# EAGLE schematic miniArduino (EAGLE 8.4.3)
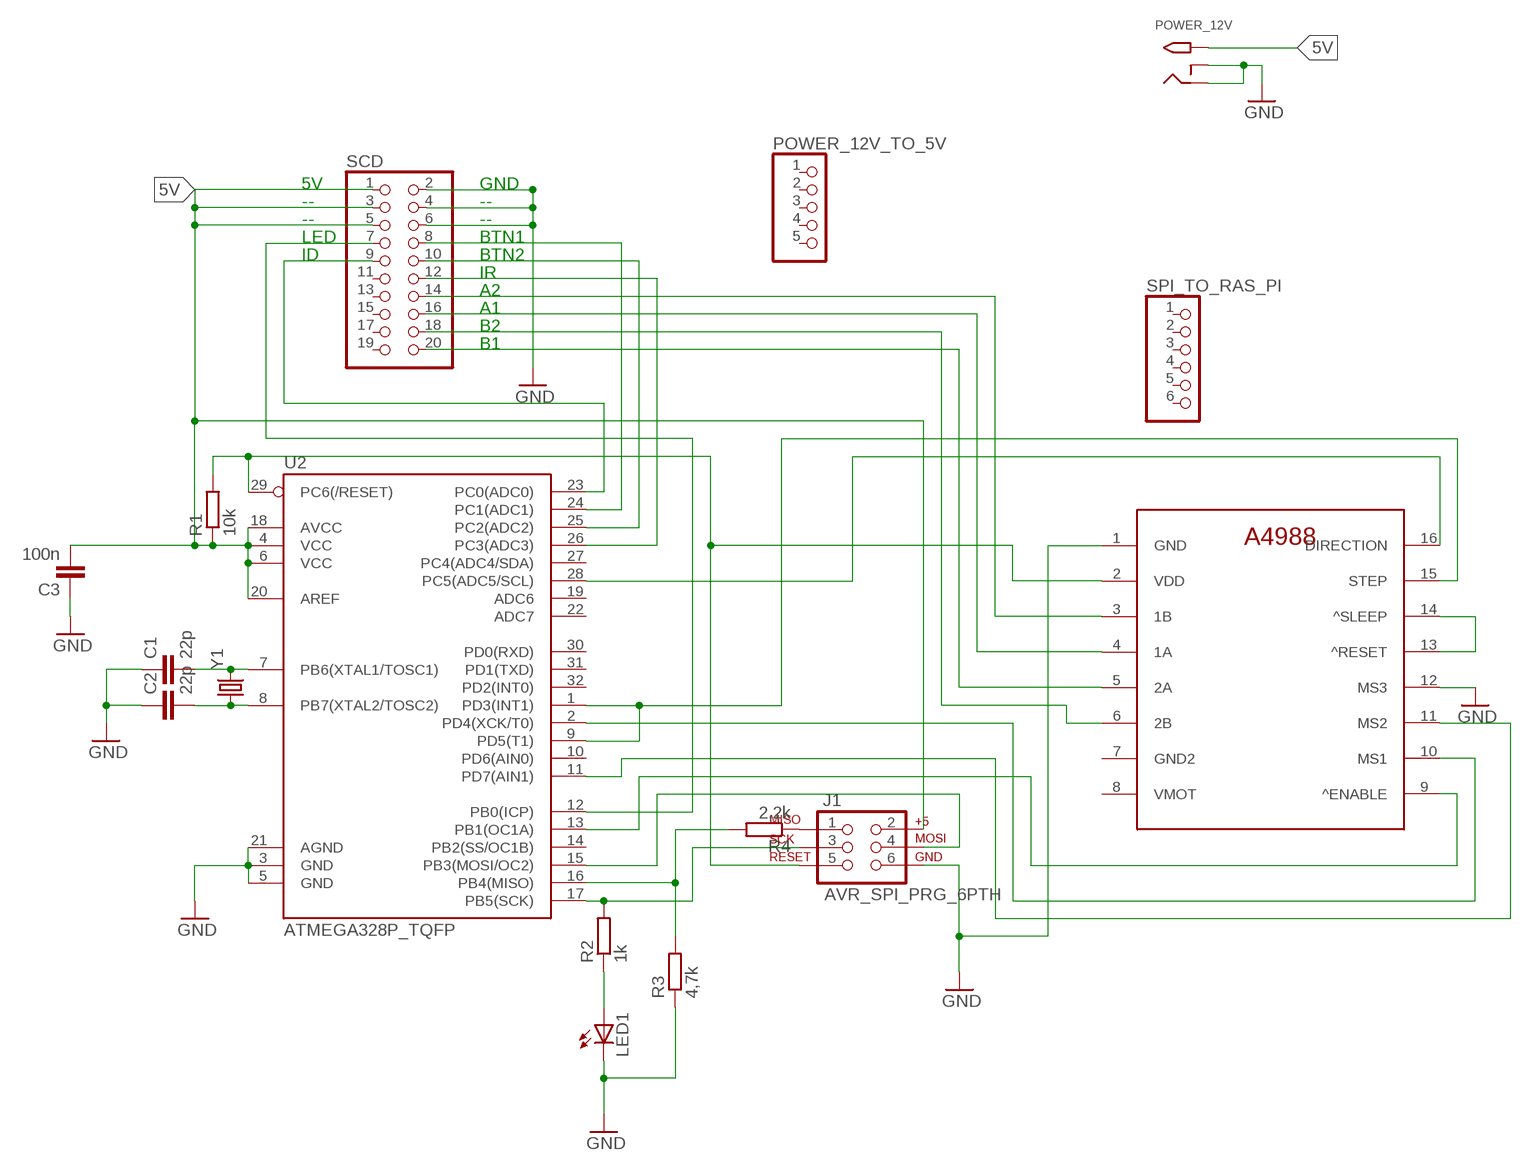
[diagram p0: schematic, sheet 1]

## Parts
C1  22p  C-EUC0805  [C0805]
C2  22p  C-EUC0805  [C0805]
C3  100n  C-EUC0805  [C0805]
J1  AVR_SPI_PRG_6PTH  [2X3]
LED1  LEDCHIP-LED0805  [CHIP-LED0805]
POWER_12V  2.1MMJACKTHM  [PJ-102A]
POWER_12V_TO_5V  PINHD-1X5_2.54  [1X05]
R1  10k  R-EU_R0805  [R0805]
R2  1k  R-EU_R0805  [R0805]
R3  4,7k  R-EU_R0805  [R0805]
R4  2,2k  R-EU_R0805  [R0805]
SCD  PINHD-2X10_2.54  [2X10]
SPI_TO_RAS_PI  PINHD-1X6  [1X06]
U2  ATMEGA328P_TQFP  [TQFP32-08]
U$1  A4998_BREAKOUT  [A4988_BREAKOUT]
Y1  CRYSTALSMD  [HC49UP]

## Nets
5V: POWER_12V.TIP
GND: C1.1 C2.1 C3.1 J1.6 LED1.C POWER_12V.RING POWER_12V.RING_SW R3.1 SCD.2 SCD.4 SCD.6 U2.3(GND) U2.5(GND) U2.21(AGND) U$1.1(GND) U$1.12(MS3)
N$1: R3.2 R4.2 U2.16(PB4(MISO))
N$2: J1.3 R2.2 U2.17(PB5(SCK))
N$3: J1.4 U2.15(PB3(MOSI/OC2))
N$4: SCD.8 U2.24(PC1(ADC1))
N$5: U2.1(PD3(INT1)) U2.9(PD5(T1)) U$1.15(STEP)
N$6: LED1.A R2.1
N$7: J1.5 R1.2 U2.29(PC6(/RESET)) U$1.2(VDD)
N$8: C1.2 U2.7(PB6(XTAL1/TOSC1)) Y1.2
N$9: C2.2 U2.8(PB7(XTAL2/TOSC2)) Y1.1
N$10: U2.13(PB1(OC1A)) U$1.9(^ENABLE)
N$11: U2.2(PD4(XCK/T0)) U$1.10(MS1)
N$12: U2.11(PD7(AIN1)) U$1.11(MS2)
N$13: U$1.13(^RESET) U$1.14(^SLEEP)
N$14: U2.28(PC5(ADC5/SCL)) U$1.16(DIRECTION)
N$15: J1.1 R4.1
N$16: C3.2 J1.2 R1.1 SCD.1 SCD.3 SCD.5 U2.4(VCC) U2.6(VCC) U2.18(AVCC) U2.20(AREF)
N$17: SCD.12 U2.26(PC3(ADC3))
N$18: SCD.14 U$1.3(1B)
N$19: SCD.16 U$1.4(1A)
N$20: SCD.20 U$1.5(2A)
N$21: SCD.18 U$1.6(2B)
N$22: SCD.7 U2.12(PB0(ICP))
N$23: SCD.10 U2.25(PC2(ADC2))
N$24: SCD.9 U2.23(PC0(ADC0))
Unconnected: POWER_12V_TO_5V.1 POWER_12V_TO_5V.2 POWER_12V_TO_5V.3 POWER_12V_TO_5V.4 POWER_12V_TO_5V.5 SCD.11 SCD.13 SCD.15 SCD.17 SCD.19 SPI_TO_RAS_PI.1 SPI_TO_RAS_PI.2 SPI_TO_RAS_PI.3 SPI_TO_RAS_PI.4 SPI_TO_RAS_PI.5 SPI_TO_RAS_PI.6 U2.10(PD6(AIN0)) U2.14(PB2(SS/OC1B)) U2.19(ADC6) U2.22(ADC7) U2.27(PC4(ADC4/SDA)) U2.30(PD0(RXD)) U2.31(PD1(TXD)) U2.32(PD2(INT0)) U$1.7(GND2) U$1.8(VMOT)

## Notes on the sheet
- 5V | GND
- -- | --
- -- | --
- LED | BTN1
- ID | BTN2
- IR
- A2
- A1
- B2
- B1

## Library data of the parts
C1-C3 = rcl:C-EU: CAPACITOR, European symbol
J1 = SparkFun-Connectors:AVR_SPI_PRG_6: AVR ISP 6 Pin This is the reduced ISP connector for AVR programming. Common on Arduino. This footprint will take up less PCB space and can be used with a 10-pin to 6-pin adapter such as SKU: BOB-08508 **Special note about "TEST_POINT" package. The stop mask is on the top side, so if you want your programming test points to be on the bottom of your board, make sure to place this package on the bottom side of the board. This also ensure that the orientation to program from the bottom side will be correct.
LED1 = adafruit:LED: LED OSRAM: - CHIPLED LG R971, LG N971, LY N971, LG Q971, LY Q971, LO R971, LY R971 LH N974, LH R974 LS Q976, LO Q976, LY Q976 LO Q996 - Hyper CHIPLED LW Q18S LB Q993, LB Q99A, LB R99A - SideLED LS A670, LO A670, LY A670, LG A670, LP A670 LB A673, LV A673, LT A673, LW A673 LH A674 LY A675 LS A676, LA A676, LO A676, LY A676, LW A676 LS A679, LY A679, LG A679 - Hyper Micro SIDELED® LS Y876, LA Y876, LO Y876, LY Y876 LT Y87S - SmartLED LW L88C, LW L88S LB L89C, LB L89S, LG L890 LS L89K, LO L89K, LY L89K LS L896, LA L896, LO L896, LY L896 - TOPLED LS T670, LO T670, LY T670, LG T670, LP T670 LSG T670, LSP T670, LSY T670, LOP T670, LYG T670 LG T671, LOG T671, LSG T671 LB T673, LV T673, LT T673, LW T673 LH T674 LS T676, LA T676, LO T676, LY T676, LB T676, LH T676, LSB T676, LW T676 LB T67C, LV T67C, LT T67C, LS T67K, LO T67K, LY T67K, LW E67C LS E67B, LA E67B, LO E67B, LY E67B, LB E67C, LV E67C, LT E67C LW T67C LS T679, LY T679, LG T679 LS T770, LO T770, LY T770, LG T770, LP T770 LB T773, LV T773, LT T773, LW T773 LH T774 LS E675, LA E675, LY E675, LS T675 LS T776, LA T776, LO T776, LY T776, LB T776 LHGB T686 LT T68C, LB T68C - Hyper Mini TOPLED® LB M676 - Mini TOPLED Santana® LG M470 LS M47K, LO M47K, LY M47K Source: http://www.osram.convergy.de/
POWER_12V = adafruit:2.1MMJACK: 2.1mm x 5.5mm THM DC jack with internal switch. Digikey part #PJ-102A, 4UCON part #05537 2.1mm x 5.5mm SMT DC jack with internal switch. Digikey part #PJ-002A-SMT, 4UCON part #03267 By microbuilder.eu & adafruit.com
POWER_12V_TO_5V = pinhead2:PINHD-1X5: PIN HEADER
R1-R4 = resistor:R-EU_: RESISTOR, European symbol
SCD = pinhead2:PINHD-2X10: PIN HEADER
SPI_TO_RAS_PI = adafruit:PINHD-1X6: PIN HEADER
U2 = SparkFun-DigitalIC:ATMEGA328P_TQFP; PROD_ID: IC-09069
U$1 = tim:A4998_BREAKOUT
Y1 = SparkFun-FreqCtrl:CRYSTAL: Various standard crystals. Proven footprints.